# Altium schematic sheet Motor Control - Top Level.SchDoc: [8] Motor Control - Top Level
size A4; ApprovedBy: Nagy Richard; CheckedBy: Nagy Richard; Author: Nagy Richard; CompanyName: EmbedCore; DrawnBy: Nagy Richard; Engineer: Nagy Richard; Organization: EmbedCore; Revision: 1.0; SheetNumber: 8; SheetTotal: 25
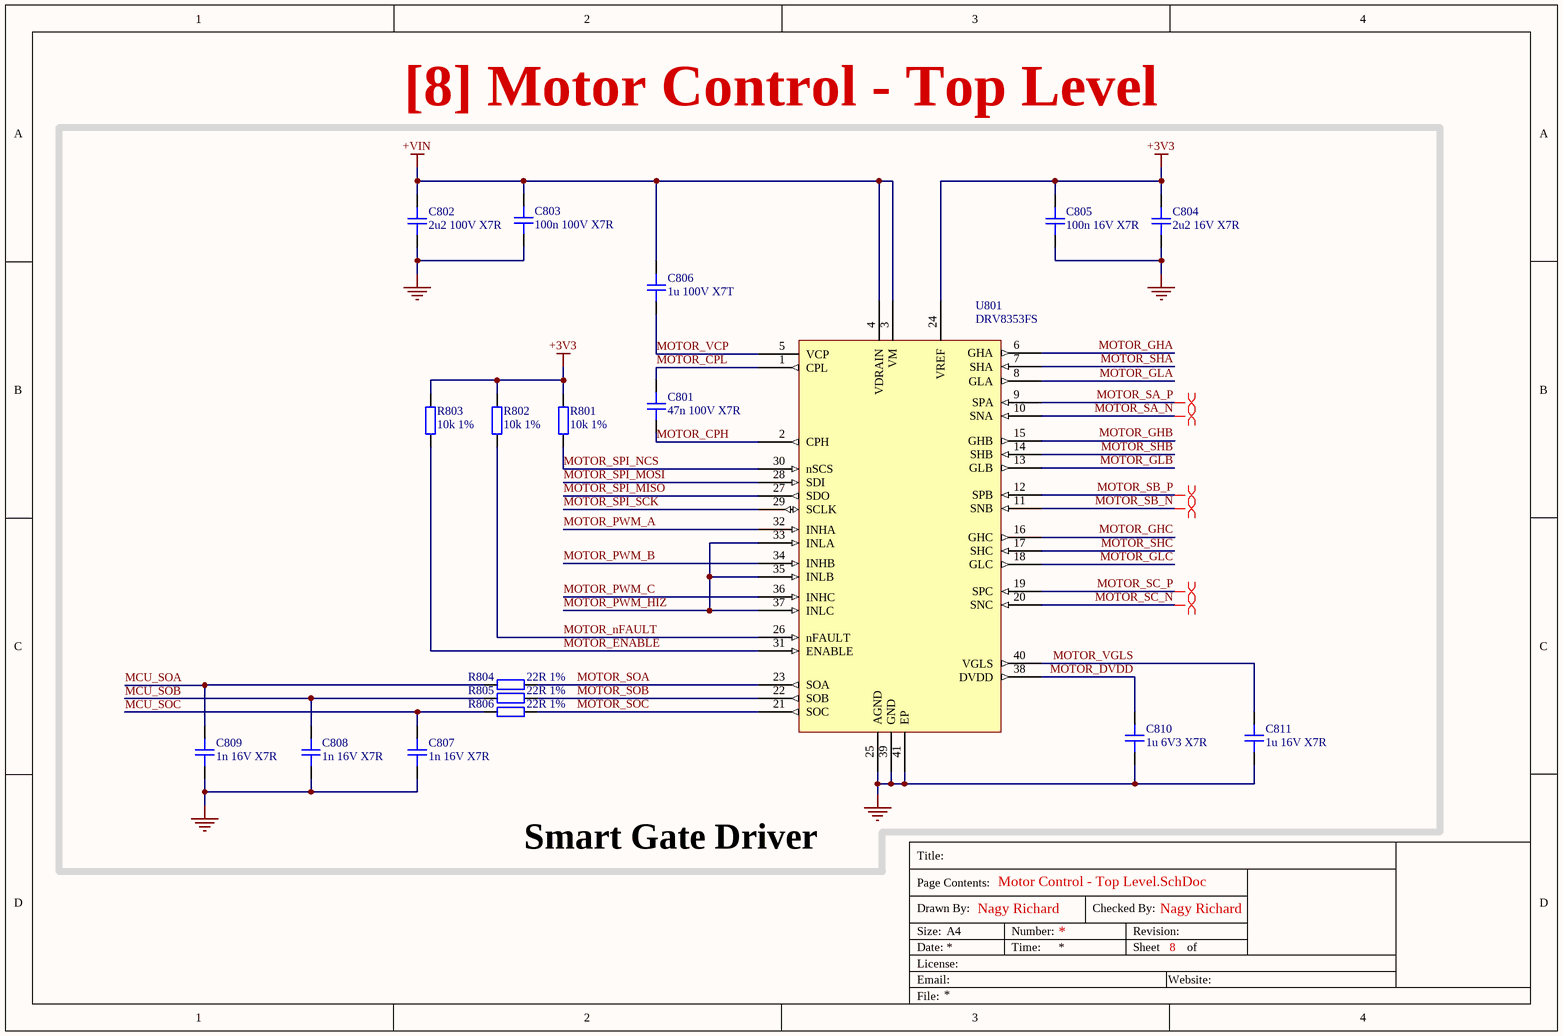
[diagram p0: Motor Control - Top Level.SchDoc]

## Parts
C801  47n 100V X7R  [CAP_0603]
C802  2u2 100V X7R  [CAP_0805]
C803  100n 100V X7R  [CAP_0603]
C804  2u2 16V X7R  [CAP_0603]
C805  100n 16V X7R  [CAP_0402]
C806  1u 100V X7T  [CAP_0603]
C807  1n 16V X7R  [CAP_0402]
C808  1n 16V X7R  [CAP_0402]
C809  1n 16V X7R  [CAP_0402]
C810  1u 6V3 X7R  [CAP_0603]
C811  1u 16V X7R  [CAP_0603]
R801  10k 1%  [RES_0402]
R802  10k 1%  [RES_0402]
R803  10k 1%  [RES_0402]
R804  22R 1%  [RES_0402]
R805  22R 1%  [RES_0402]
R806  22R 1%  [RES_0402]
U801  DRV8353FS  [QFN50P600X600X80-41N-D]

## Blocks framed on the sheet
Smart Gate Driver: C801-C811 R801-R806 U801

## Nets
+3V3: C804.2 C805.2 R801.2 R802.2 R803.2 U801.24(VREF)
+VIN: C802.2 C803.2 C806.2 U801.3(VM) U801.4(VDRAIN)
GND: C802.1 C803.1 C804.1 C805.1 C807.1 C808.1 C809.1 C810.1 C811.1 U801.25(AGND) U801.39(GND) U801.41(EP)
MCU_SOA: C809.2 R804.2
MCU_SOB: C808.2 R805.2
MCU_SOC: C807.2 R806.2
MOTOR_CPH: C801.1 U801.2(CPH)
MOTOR_CPL: C801.2 U801.1(CPL)
MOTOR_DVDD: C810.2 U801.38(DVDD)
MOTOR_ENABLE: R803.1 U801.31(ENABLE)
MOTOR_GHA: U801.6(GHA)
MOTOR_GHB: U801.15(GHB)
MOTOR_GHC: U801.16(GHC)
MOTOR_GLA: U801.8(GLA)
MOTOR_GLB: U801.13(GLB)
MOTOR_GLC: U801.18(GLC)
MOTOR_nFAULT: R802.1 U801.26(nFAULT)
MOTOR_PWM_A: U801.32(INHA)
MOTOR_PWM_B: U801.34(INHB)
MOTOR_PWM_C: U801.36(INHC)
MOTOR_PWM_HIZ: U801.33(INLA) U801.35(INLB) U801.37(INLC)
MOTOR_SA_N: U801.10(SNA)
MOTOR_SA_P: U801.9(SPA)
MOTOR_SB_N: U801.11(SNB)
MOTOR_SB_P: U801.12(SPB)
MOTOR_SC_N: U801.20(SNC)
MOTOR_SC_P: U801.19(SPC)
MOTOR_SHA: U801.7(SHA)
MOTOR_SHB: U801.14(SHB)
MOTOR_SHC: U801.17(SHC)
MOTOR_SOA: R804.1 U801.23(SOA)
MOTOR_SOB: R805.1 U801.22(SOB)
MOTOR_SOC: R806.1 U801.21(SOC)
MOTOR_SPI_MISO: U801.27(SDO)
MOTOR_SPI_MOSI: U801.28(SDI)
MOTOR_SPI_NCS: R801.1 U801.30(nSCS)
MOTOR_SPI_SCK: U801.29(SCLK)
MOTOR_VCP: C806.1 U801.5(VCP)
MOTOR_VGLS: C811.2 U801.40(VGLS)

## Layout directives
differential pair: MOTOR_SA_N, MOTOR_SA_P, MOTOR_SB_N, MOTOR_SB_P, MOTOR_SC_N, MOTOR_SC_P

## Notes on the sheet
- Title:
- Drawn By:
- Page Contents:
- Checked By:
- Size:
- Date:
- File:
- License:
- Email:
- A4
- Number:
- Time:
- Revision:
- Sheet
- Website:
- of

## Library data of the parts
C801 = CAP_0603: Capacitor SMD 0603; Manufacturer: YAGEO; Manufacturer Part Number: CC0603KRX7R0BB473; Distributor Link: www.lcsc.com; LCSC: C576852; Rating: *; Dielectric: *
C802 = CAP_0805: Capacitor SMD 0805; Manufacturer: HRE; Manufacturer Part Number: CGA0805X7R225K101MT; Distributor Link: www.lcsc.com; LCSC: C6119935; Rating: *; Dielectric: *
C803 = CAP_0603: Capacitor SMD 0603; Manufacturer: YAGEO; Manufacturer Part Number: AC0603KRX7R0BB104; Distributor Link: www.lcsc.com; LCSC: C408909; Rating: *; Dielectric: *
C804 = CAP_0603: Capacitor SMD 0603; Manufacturer: YAGEO; Manufacturer Part Number: CC0603KRX7R7BB225; Distributor Link: www.lcsc.com; LCSC: C914769; Rating: *; Dielectric: *
C805 = CAP_0402: Capacitor SMD 0402; Manufacturer: YAGEO; Manufacturer Part Number: CC0402JRX7R7BB104; Distributor Link: www.lcsc.com; LCSC: C541464; Rating: *; Dielectric: *
C806 = CAP_0603: Capacitor SMD 0603; Manufacturer: Murata Electronics; Manufacturer Part Number: GRM188D72A105KE01D; Distributor Link: www.lcsc.com; LCSC: C23829972; Rating: *; Dielectric: *
C807-C809 = CAP_0402: Capacitor SMD 0402; Manufacturer: YAGEO; Manufacturer Part Number: AC0402KRX7R7BB102; Distributor Link: www.lcsc.com; LCSC: C726514; Rating: *; Dielectric: *
C810 = CAP_0603: Capacitor SMD 0603; Manufacturer: YAGEO; Manufacturer Part Number: CC0603KRX7R5BB105; Distributor Link: www.lcsc.com; LCSC: C309479; Rating: *; Dielectric: *
C811 = CAP_0603: Capacitor SMD 0603; Manufacturer: Murata Electronics; Manufacturer Part Number: GRM188R71C105ME15D; Distributor Link: www.lcsc.com; LCSC: C723883; Rating: *; Dielectric: *
R801-R803 = RES_0402: Resistor SMD 0402; Manufacturer: PANASONIC; Manufacturer Part Number: ERJPA2F1002X; Distributor Link: www.lcsc.com; LCSC: C427247
R804-R806 = RES_0402: Resistor SMD 0402; Manufacturer: PANASONIC; Manufacturer Part Number: ERJPA2F22R0X; Distributor Link: www.lcsc.com; LCSC: C427230
U801 = DRV8353FS: DRV835xF 100-V Three-Phase Smart Gate Driver; Manufacturer: *; Manufacturer Part Number: *; Distributor Link: *; LCSC: *